# EAGLE design Baos_Board (EAGLE 9.3.0)

## Sheet 1 of 3
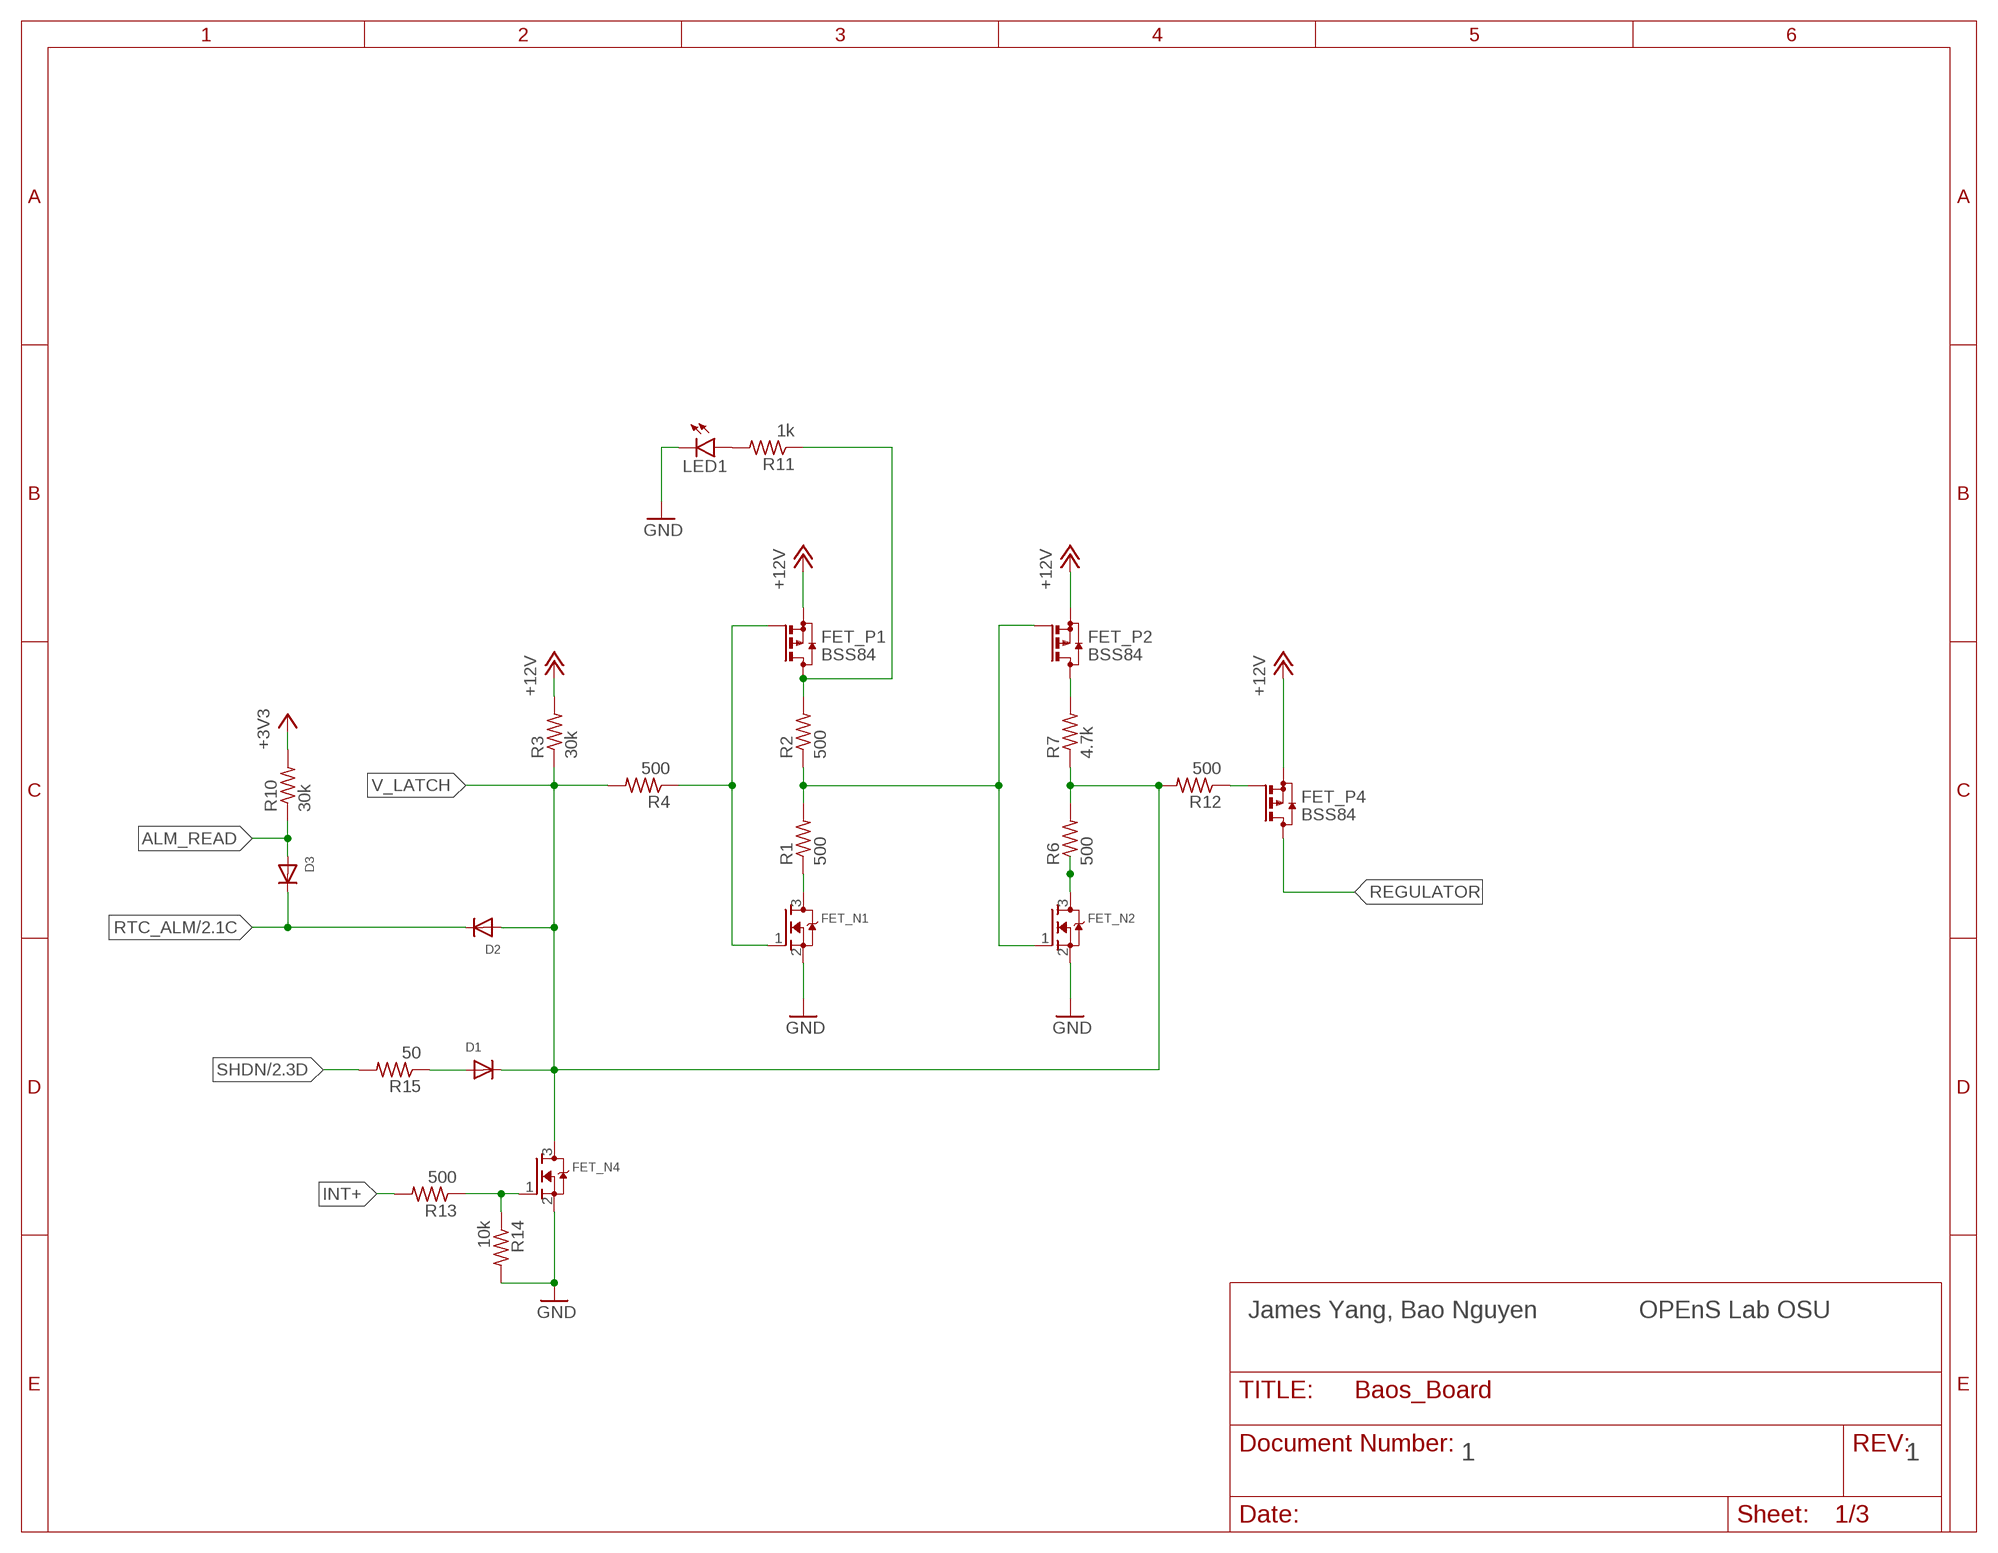
[diagram p0: schematic, sheet 1]

### Parts
D1  DIODESOD-123  [SOD-123]
D2  DIODESOD-123  [SOD-123]
D3  DIODESOD-123  [SOD-123]
FET_N1  MOSFET-NREFLOW  [SOT23]
FET_N2  MOSFET-NREFLOW  [SOT23]
FET_N4  MOSFET-NREFLOW  [SOT23]
FET_P1  BSS84  [SOT23]
FET_P2  BSS84  [SOT23]
FET_P4  BSS84  [SOT23]
LED1  LEDSMT1206  [1206]
R1  500  R-US_R0805  [R0805]
R2  500  R-US_R0805  [R0805]
R3  30k  R-US_R0805  [R0805]
R4  500  R-US_R0805  [R0805]
R6  500  R-US_R0805  [R0805]
R7  4.7k  R-US_R0805  [R0805]
R10  30k  R-US_R0805  [R0805]
R11  1k  R-US_R0805  [R0805]
R12  500  R-US_R0805  [R0805]
R13  500  R-US_R0805  [R0805]
R14  10k  R-US_R0805  [R0805]
R15  50  R-US_R0805  [R0805]

### Nets
+3V3: R10.2 ; also sheet 2
+12V: FET_P1.2(S) FET_P2.2(S) FET_P4.2(S) R3.2 ; also sheet 2
ALM_READ: D3.A R10.1 ; also sheet 2
GND: FET_N1.2(S) FET_N2.2(S) FET_N4.2(S) LED1.C R14.2 ; also sheet 2
INT+: R13.2
N$1: FET_P1.3(D) R2.2 R11.1
N$2: FET_N1.3(D) R1.1
N$3: FET_N1.1(G) FET_P1.1(G) R4.1
N$4: FET_N2.1(G) FET_P2.1(G) R1.2 R2.1
N$6: FET_P2.3(D) R7.2
N$7: FET_N2.3(D) R6.1
N$9: LED1.A R11.2
N$10: FET_P4.1(G) R12.1
N$11: D1.A R15.1
N$12: FET_N4.1(G) R13.1 R14.1
REGULATOR: FET_P4.3(D) ; also sheet 2
RTC_ALM: D2.C D3.C ; also sheet 2
SHDN: R15.2 ; also sheet 2
V_LATCH: D1.C D2.A FET_N4.3(D) R3.1 R4.2 R6.2 R7.1 R12.2 ; also sheet 2

### Notes on the sheet
- James Yang, Bao Nguyen | OPEnS Lab OSU
- 1 | 1

## Sheet 2 of 3
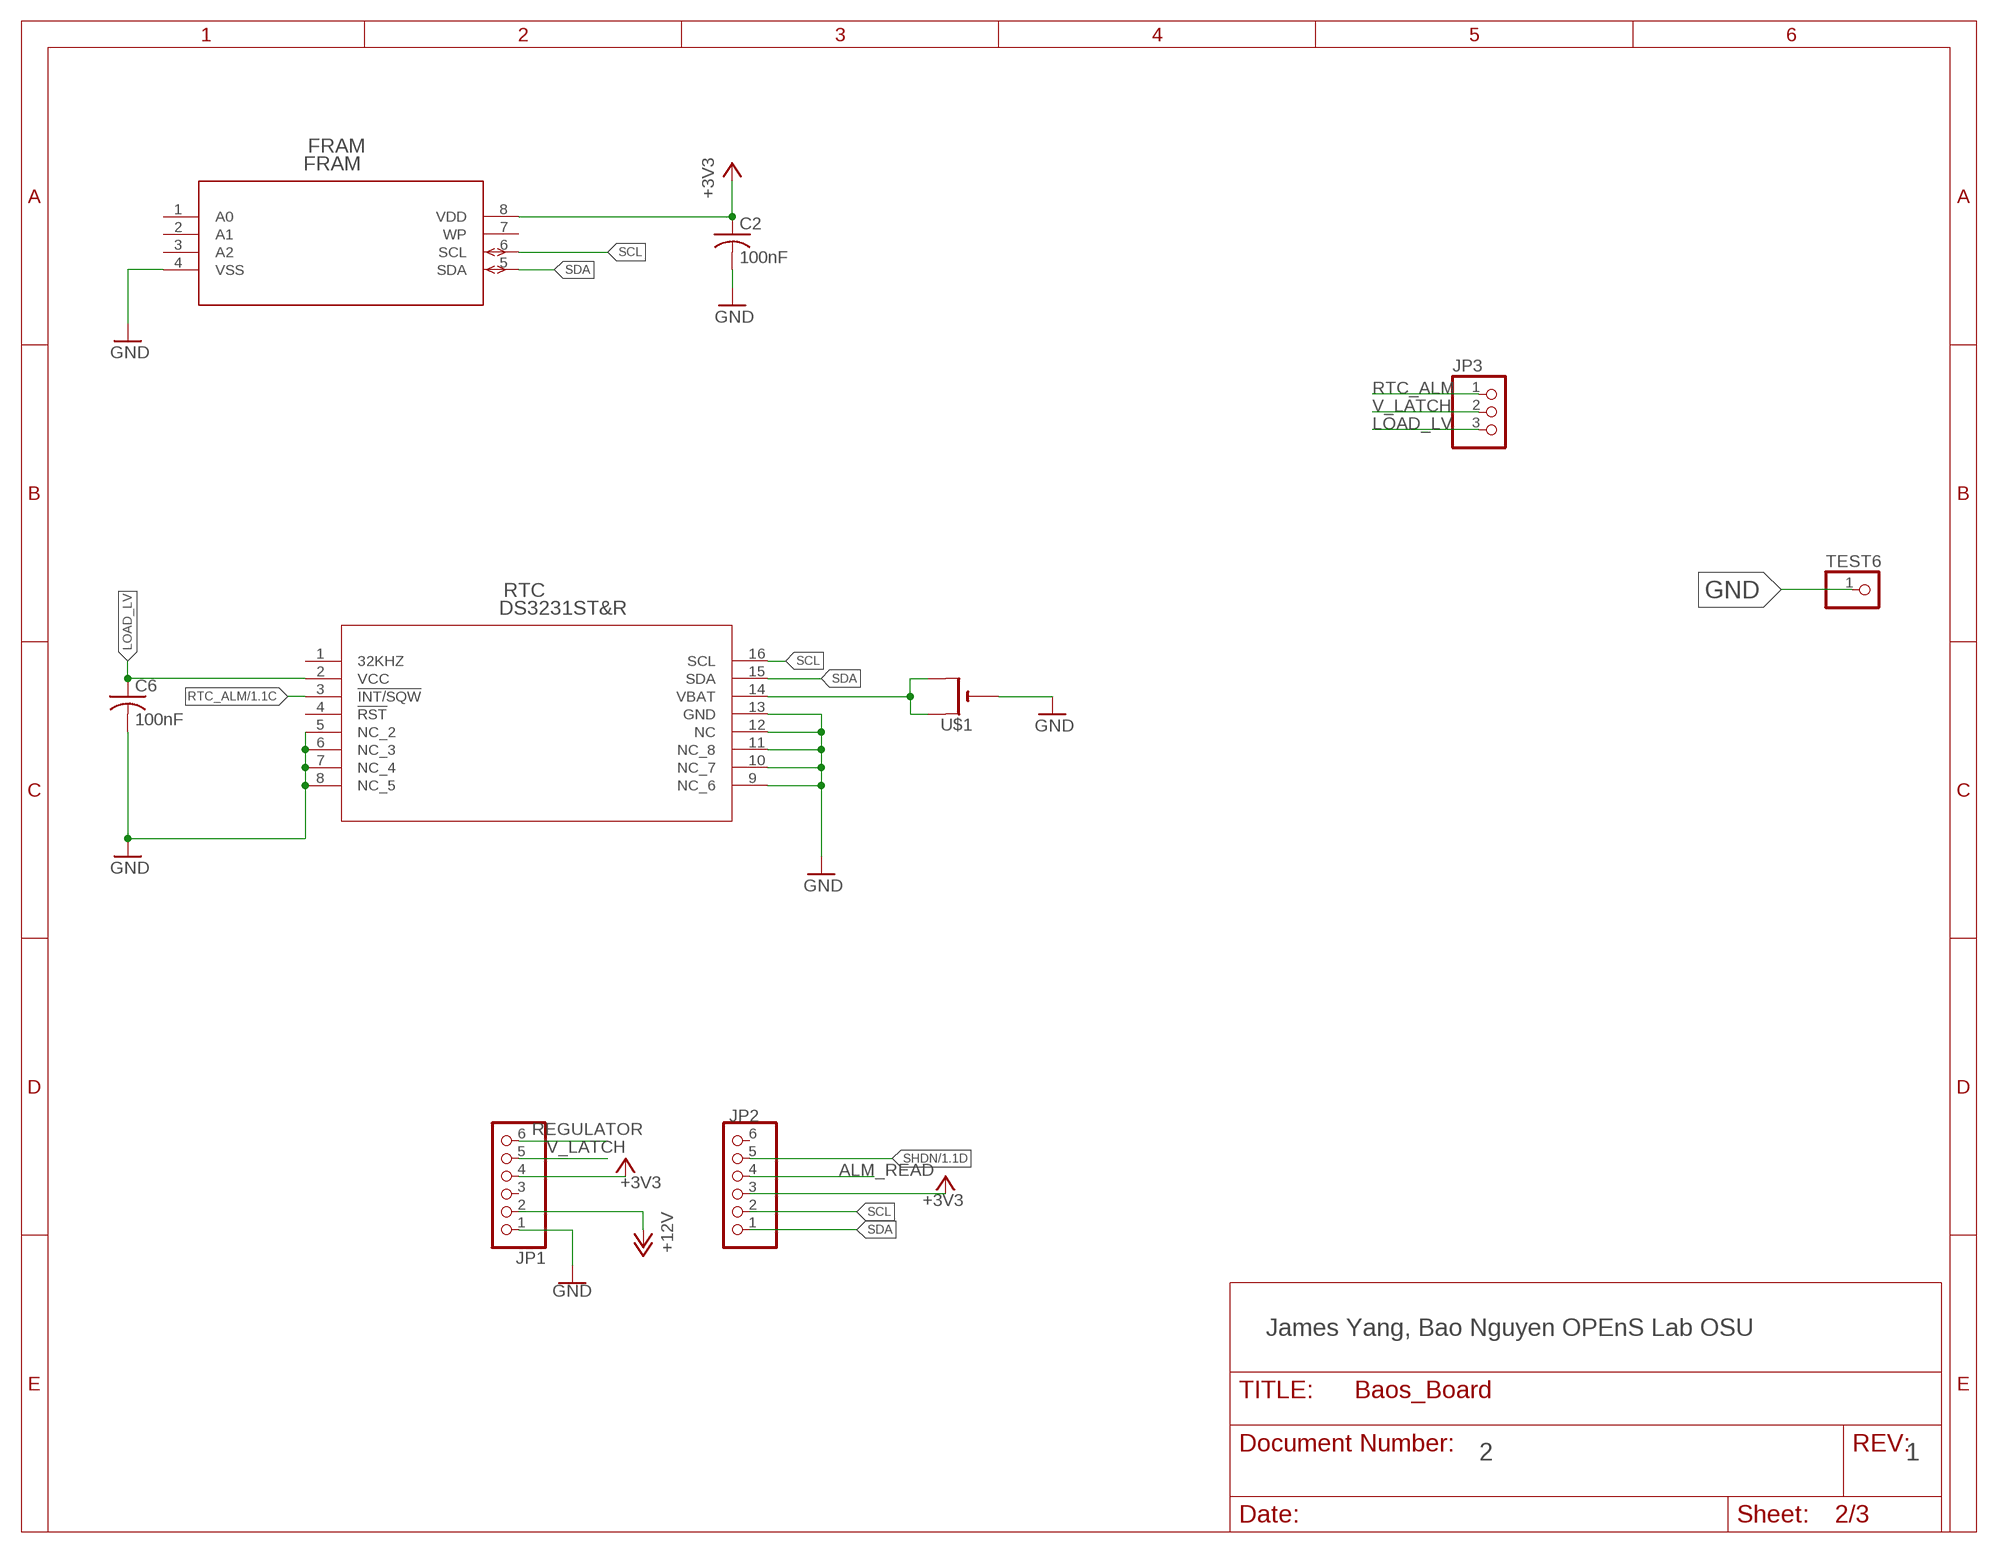
[diagram p1: schematic, sheet 2]

### Parts
C2  100nF  C-USC0805  [C0805]
C6  100nF  C-USC0805  [C0805]
FRAM  FRAM  [FPT-8P-M02]
JP1  PINHD-1X6  [1X06]
JP2  PINHD-1X6  [1X06]
JP3  PINHD-1X3  [1X03]
RTC  DS3231ST&R  [21-0042B_16]
TEST6  PINHD-1X1  [1X01]
U$1  CR1220SMT  [CR1220-SMD]

### Nets
+3V3: C2.1 FRAM.8(VDD) JP1.4 JP2.3 ; also sheet 1
+12V: JP1.2 ; also sheet 1
ALM_READ: JP2.4 ; also sheet 1
GND: C2.2 C6.2 FRAM.4(VSS) JP1.1 RTC.5(NC_2) RTC.6(NC_3) RTC.7(NC_4) RTC.8(NC_5) RTC.9(NC_6) RTC.10(NC_7) RTC.11(NC_8) RTC.12(NC) RTC.13(GND) TEST6.1 U$1.- ; also sheet 1
LOAD_LV: C6.1 JP3.3 RTC.2(VCC)
N$5: RTC.14(VBAT) U$1.+$1(+) U$1.+$2(+1)
REGULATOR: JP1.6 ; also sheet 1
RTC_ALM: JP3.1 RTC.3(!INT/SQW) ; also sheet 1
SCL: FRAM.6(SCL) JP2.2 RTC.16(SCL)
SDA: FRAM.5(SDA) JP2.1 RTC.15(SDA)
SHDN: JP2.5 ; also sheet 1
V_LATCH: JP1.5 JP3.2 ; also sheet 1
Unconnected: FRAM.1(A0) FRAM.2(A1) FRAM.3(A2) FRAM.7(WP) JP1.3 JP2.6 RTC.1(32KHZ) RTC.4(!RST)

### Notes on the sheet
- James Yang, Bao Nguyen OPEnS Lab OSU
- 2 | 1

## Sheet 3 of 3

## Library data of the parts
C2 C6 = adafruit:C-US: CAPACITOR, American symbol
D1-D3 = adafruit:DIODE: Diode SMADIODE - SMA Surface Mount Package 20V 1A Schottky Diode Digikey: 641-1014-6-ND DO-1N4148 - Through Hole Small Current Diode SOD-123 20V 1 A (.5mV Vf) Schottky Diode - Digikey: MBRX120TPMSCT-ND SOD-323 10V 570mA (.38mV Vf, 3ns) Schottky Diode - Digikey: ZLLS410CT-ND SOD-523 30V 30mA Schottky Diode (RB751S-40TE61) - Digikey: RB751S-40TE61CT-ND SOT23-R/W - SOT23 Package (R = Solder Paste/Reflow Ovens, W = Hand-Soldering) BAT54Film 40V 300mA - Digikey: 497-7162-1-ND
FET_N1 FET_N2 FET_N4 = adafruit:MOSFET-N: N-Channel Mosfet 2N7002E - 60V 260mA SOT23 [Digikey: 2N7002ET1GOSTR-ND] - REEL BSH103 - 30V 850mA SOT23 [Digikey: 568-5013-1-ND]
FET_P1 FET_P2 FET_P4 = transistor-small-signal:BSS84: P-CHANNEL MOS FET
FRAM = power8:FRAM: MB85RC128APNF-G-JNE1, FRAM 128k, 128kb, I2C; MANUFACTURER_PART_NUMBER: Inc.; VENDOR: Fujitsu Semiconductor
JP1 JP2 = adafruit:PINHD-1X6: PIN HEADER
JP3 = adafruit:PINHD-1X3: PIN HEADER
LED1 = led:LED: LED OSRAM: - CHIPLED LG R971, LG N971, LY N971, LG Q971, LY Q971, LO R971, LY R971 LH N974, LH R974 LS Q976, LO Q976, LY Q976 LO Q996 - Hyper CHIPLED LW Q18S LB Q993, LB Q99A, LB R99A - SideLED LS A670, LO A670, LY A670, LG A670, LP A670 LB A673, LV A673, LT A673, LW A673 LH A674 LY A675 LS A676, LA A676, LO A676, LY A676, LW A676 LS A679, LY A679, LG A679 - Hyper Micro SIDELED® LS Y876, LA Y876, LO Y876, LY Y876 LT Y87S - SmartLED LW L88C, LW L88S LB L89C, LB L89S, LG L890 LS L89K, LO L89K, LY L89K LS L896, LA L896, LO L896, LY L896 - TOPLED LS T670, LO T670, LY T670, LG T670, LP T670 LSG T670, LSP T670, LSY T670, LOP T670, LYG T670 LG T671, LOG T671, LSG T671 LB T673, LV T673, LT T673, LW T673 LH T674 LS T676, LA T676, LO T676, LY T676, LB T676, LH T676, LSB T676, LW T676 LB T67C, LV T67C, LT T67C, LS T67K, LO T67K, LY T67K, LW E67C LS E67B, LA E67B, LO E67B, LY E67B, LB E67C, LV E67C, LT E67C LW T67C LS T679, LY T679, LG T679 LS T770, LO T770, LY T770, LG T770, LP T770 LB T773, LV T773, LT T773, LW T773 LH T774 LS E675, LA E675, LY E675, LS T675 LS T776, LA T776, LO T776, LY T776, LB T776 LHGB T686 LT T68C, LB T68C - Hyper Mini TOPLED® LB M676 - Mini TOPLED Santana® LG M470 LS M47K, LO M47K, LY M47K Source: http://www.osram.convergy.de LUXEON: - LUMILED® LXK2-PW12-R00, LXK2-PW12-S00, LXK2-PW14-U00, LXK2-PW14-V00 LXK2-PM12-R00, LXK2-PM12-S00, LXK2-PM14-U00 LXK2-PE12-Q00, LXK2-PE12-R00, LXK2-PE12-S00, LXK2-PE14-T00, LXK2-PE14-U00 LXK2-PB12-K00, LXK2-PB12-L00, LXK2-PB12-M00, LXK2-PB14-N00, LXK2-PB14-P00, LXK2-PB14-Q00 LXK2-PR12-L00, LXK2-PR12-M00, LXK2-PR14-Q00, LXK2-PR14-R00 LXK2-PD12-Q00, LXK2-PD12-R00, LXK2-PD12-S00 LXK2-PH12-R00, LXK2-PH12-S00 LXK2-PL12-P00, LXK2-PL12-Q00, LXK2-PL12-R00 Source: www.luxeon.com KINGBRIGHT: KA-3528ASYC Source: www.kingbright.com
R1-R4 R6 R7 R10-R15 = rcl:R-US_: RESISTOR, American symbol; SPICEPREFIX: R
RTC = power8:DS3231ST&R: DS3231 RTC IC only; MANUFACTURER_PART_NUMBER: DS3231S#T&R; VENDOR: Maxim Integrated Products
TEST6 = pinhead:PINHD-1X1: PIN HEADER
U$1 = adafruit:CR1220: CR1216/CR1220/CR1225 12mm 3V lithium coin cell Great for battery packup. Both SMT and THM holders. Note the THM package has the ground pads on both sides of the PCB so that the masks are the same - this reduces the cost

## Board
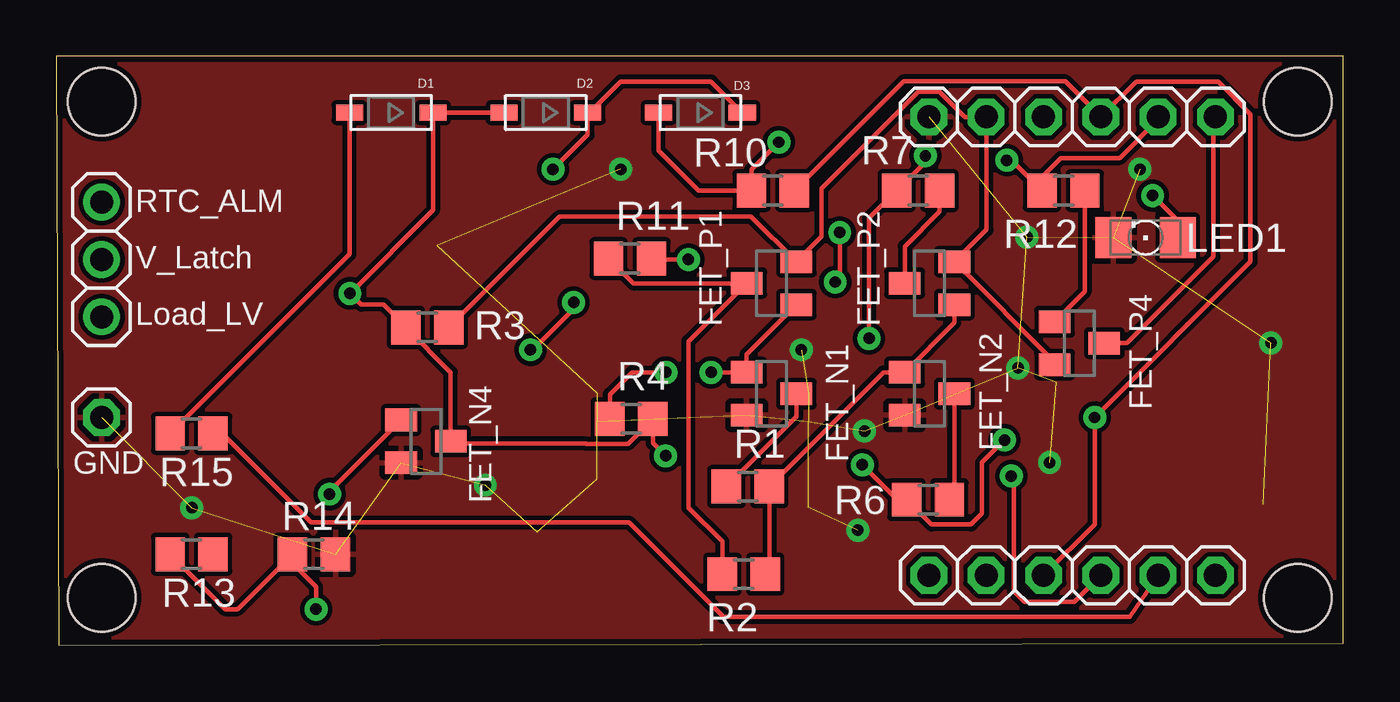
[diagram p2: board, top side]
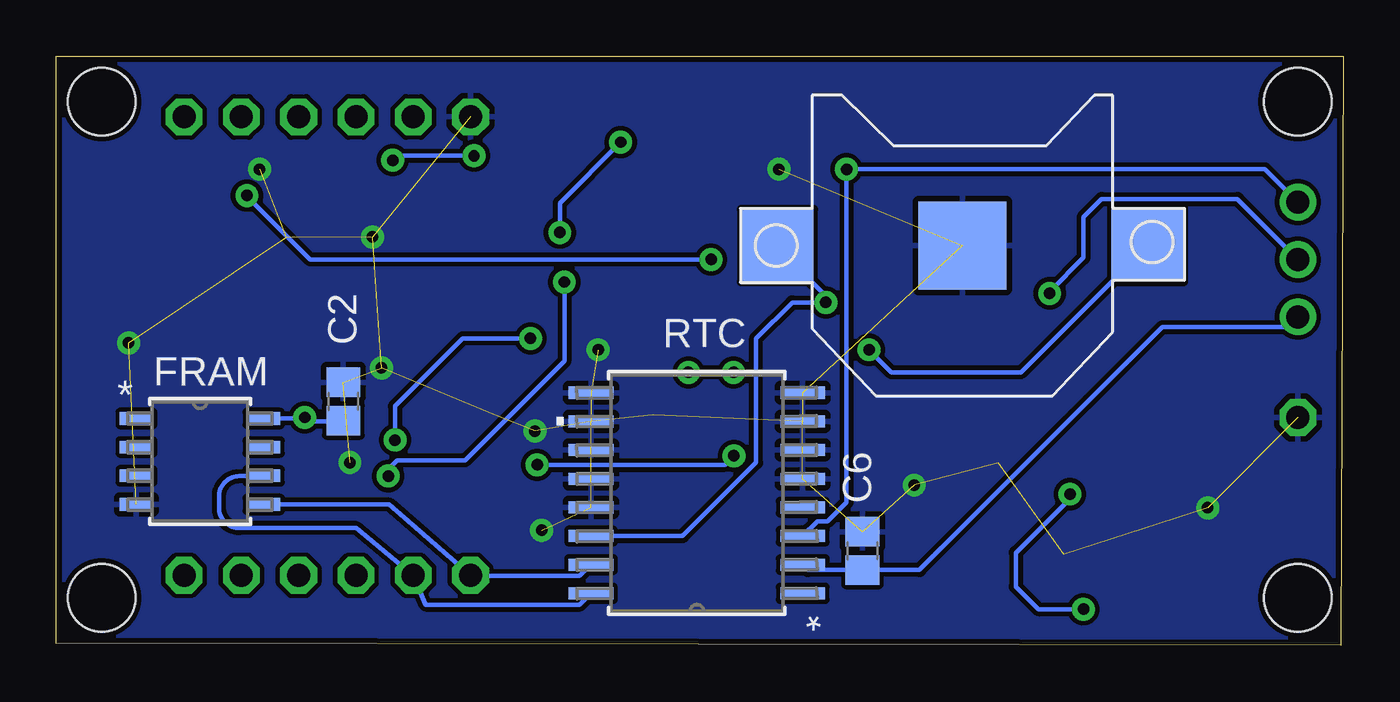
[diagram p3: board, bottom side, seen from below]

Size 57 x 26.1 mm. Coordinates in mm from the lower left corner, seen from the top.
Outline: 0.1,0 57,0.1 57,26.1 0,26.1 0.1,0
Copper layers (1*16): Top 0.035mm / dielectric 1.5mm / Bottom 0.035mm
Design rules "SparkFun": minimum track width 8mil, minimum drill 20mil, track to track 8mil, track to pad 8mil, pad to pad 8mil, via to via 8mil, smd to smd 8mil, copper to edge 10mil, drill to drill 8mil, minimum pad ring 12mil, minimum via ring 10mil, stop-mask expansion 4mil, vias tented up to drill 25mil, thermal gap 10mil
Holes 3 mm at 55,24.1 55,2.1 2,24.1 2,2.1

### Footprints (pad centres in the part's own frame; a part is rotated, then mirrored left to right if it is on the bottom)
C0805 = smd 1.3 x 1.5: 1 -0.85,0; 2 0.85,0
SOD-123 = smd 1.2 x 0.7: A 1.85,0; C -1.85,0
SOT23 = smd 1 x 1.4: 1 -0.95,-1.1; 2 0.95,-1.1; 3 0,1.1
FPT-8P-M02 = smd 1.473 x 0.559: 1 -2.819,1.905; 2 -2.819,0.635; 3 -2.819,-0.635; 4 -2.819,-1.905; 5 2.819,-1.905; 6 2.819,-0.635; 7 2.819,0.635; 8 2.819,1.905
1X06 = drill 1.016 octagon: 1 -6.35,0; 2 -3.81,0; 3 -1.27,0; 4 1.27,0; 5 3.81,0; 6 6.35,0
1X03 = drill 1.016: 1 -2.54,0; 2 0,0; 3 2.54,0
1206 = smd 1.6 x 1.803: A -1.422,0; C 1.422,0
R0805 = smd 1.3 x 1.5: 1 -0.95,0; 2 0.95,0
21-0042B_16 = smd 1.981 x 0.533: 1 -4.686,4.445; 2 -4.686,3.175; 3 -4.686,1.905; 4 -4.686,0.635; 5 -4.686,-0.635; 6 -4.686,-1.905; 7 -4.686,-3.175; 8 -4.686,-4.445; 9 4.686,-4.445; 10 4.686,-3.175; 11 4.686,-1.905; 12 4.686,-0.635; 13 4.686,0.635; 14 4.686,1.905; 15 4.686,3.175; 16 4.686,4.445
1X01 = drill 1.016 octagon: 1 0,0
CR1220-SMD = smd 3.2 x 3.2: +$1 -8.2,0; +$2 8.2,0 | smd 3.9 x 3.9: - 0,0

### Placement (x,y rotation side)
C2  44.29,10.81 90 bottom
C6  21.29,4.19 90 bottom
D1  14.83,23.61 180 top
D2  21.68,23.61 180 top
D3  28.53,23.61 180 top
FET_N1  31.68,11.15 270 top
FET_N2  38.68,11.15 270 top
FET_N4  16.37,9.04 270 top
FET_P1  31.68,16.05 90 top
FET_P2  38.68,16.05 90 top
FET_P4  45.32,13.39 270 top
FRAM  50.64,8.15 0 bottom
JP1  45,23.42 0 top
JP2  45,3.1 0 top
JP3  2,17.1 270 top
LED1  48.25,18.07 180 top
R1  30.63,7.04 0 top
R2  30.45,3.16 180 top
R3  16.43,14.09 0 top
R4  25.47,10.04 0 top
R6  38.61,6.46 180 top
R7  38.17,20.15 0 top
R10  31.74,20.15 0 top
R11  25.41,17.14 0 top
R12  44.61,20.15 180 top
R13  5.99,4.04 0 top
R14  11.41,4.04 0 top
R15  5.99,9.39 0 top
RTC  28.63,6.75 180 bottom
TEST6  2,10.1 0 top
U$1  16.86,17.72 0 bottom

### Tracks (layer width: path | path; a pad name or v marks a point on that pad's centre or on a via)
+3V3  (via drill 0.51)
  Top 0.203: JP2.3 46,5.37 v46,10.1 52.9,17 52.9,23.55 51.46,24.98 47.83,24.98 JP1.4 44.69,25 37.54,25 R10.2
  Bottom 0.203: C2.1 44.33,9.92 45.83,9.92 v46,10.1 46.05,10.05 FRAM.8
+12V
  Top 0.203: FET_P4.2 44.22,12.56 FET_P2.2 41.2,18.42 JP1.2 | R3.2 22.29,19 30.78,19 FET_P1.2 33.89,18.11 33.89,20.24 38.19,24.54 39.11,24.54 40.24,23.41 JP1.2 | JP1.2
ALM_READ  (via drill 0.51)
  Top 0.203: D3.A 26.68,21.92 28.45,20.15 R10.1 30.79,21.09 v32,22.3 | v34.7,18.3 34.7,16.3 v34.5,16.1 | v42.3,7.5 42.42,7.38 42.42,2.39 42.88,1.93 45.1,1.93 JP2.4
  Bottom 0.203: v34.5,16.1 34.5,12.6 38.9,8.2 41.9,8.2 42.3,7.8 v42.3,7.5 | v34.7,18.3 34.7,19.6 v32,22.3
GND  (via drill 0.51)  (30 unrouted)
  other vias: 35.8,9.5 53.8,13.4 25,21.1 6,6.1 43,18.1 48,21.1 35.5,5.1 44,8.1 42.6,12.3 19,7.1 33,13.1
  pour Bottom: 0.2,26 0.2,0.1 56.7,0.1 56.7,26
  pour Top: 0.2,26 0.2,0.1 56.6,0.1 56.6,26
LOAD_LV
  Bottom 0.203: RTC.2 23.71,3.34 C6.1 18.76,3.34 8,14.1 2.46,14.1 JP3.3
N$1
  Top 0.203: R2.2 29.5,4.6 28,6.1 28,13.47 30.57,16.04 | 30.57,16.04 FET_P1.3 | R11.1 25.57,16.04 30.57,16.04
N$2
  Top 0.203: R1.1 32.78,10.14 FET_N1.3
N$3  (via drill 0.51)
  Top 0.203: R4.1 24.52,11.12 25.5,12.1 v27,12.1 | v29,12.1 FET_N1.1 30.58,12.9 FET_P1.1
  Bottom 0.203: v27,12.1 v29,12.1
N$4
  Top 0.203: R2.1 31.58,3.34 R1.2 36.64,12.1 FET_N2.1 39.78,14.3 FET_P2.1
N$5  (via drill 0.51)
  Top 0.203: v21,13.1 21.1,13.1 22.91,14.91 v22.91,15.2
  Bottom 0.203: U$1.+$2 14.28,12.1 20,12.1 v21,13.1 | U$1.+$1 25.06,17.62 22.91,15.47 v22.91,15.2 24.4,15.2 26,13.6 26,8.1 29.25,4.84 RTC.14
N$6
  Top 0.203: R7.2 39.12,19.23 37.58,17.68 FET_P2.3
N$7
  Top 0.203: R6.1 39.78,6.68 FET_N2.3
N$9  (via drill 0.51)
  Top 0.203: v28,17.1 26.4,17.1 R11.2 | v48.56,19.94 49.67,18.83 LED1.A
  Bottom 0.203: v28,17.1 45.76,17.1 48.56,19.9 v48.56,19.94
N$10
  Top 0.203: R12.1 45.56,15.68 FET_P4.1
N$11
  Top 0.203: R15.1 12.98,17.33 D1.A
N$12  (via drill 0.51)
  Top 0.203: R13.1 7.48,1.6 8.02,1.6 10.26,3.84 | 10.26,3.84 R14.1 | FET_N4.1 12.1,6.82 v12.1,6.7 | v11.5,1.6 11.5,2.6 10.26,3.84
  Bottom 0.203: v12.1,6.7 12.1,6.5 14.5,4.1 14.5,2.6 13.5,1.6 v11.5,1.6
REGULATOR
  Top 0.203: FET_P4.3 47.42,13.39 51.25,17.22 51.25,23.32 JP1.6
RTC_ALM  (via drill 0.51)
  Top 0.203: v22,21.1 23.53,22.63 D2.C | D2.C | D3.C 29.01,24.98 25,24.98 23.62,23.6 D2.C
  Bottom 0.203: RTC.3 23.29,5.49 22.85,5.49 22,6.34 v22,21.1 3.46,21.1 JP3.1
SCL
  Bottom 0.203: FRAM.6 arc90 47.84,7.5 48.9,7.5 arc-90 49.8,6.6 49.8,6.1 arc-90 48.9,5.2 43.73,5.2 JP2.2 40.64,1.81 33.82,1.81 RTC.16
SDA
  Bottom 0.203: FRAM.5 42.26,6.24 JP2.1 38.62,3.08 33.82,3.08 RTC.15
SHDN
  Top 0.203: R15.2 7.34,9.39 11.29,5.44 25.36,5.44 29.55,1.26 47.55,1.26 JP2.5
V_LATCH  (via drill 0.51)
  Top 0.203: D2.A D1.C 16.68,19.28 v13,15.6 13.5,15.1 14.5,15.1 15.49,14.11 R3.1 17.47,12.1 FET_N4.3 17.57,8.94 23.46,8.94 25.32,8.94 R4.2 26.42,8.97 v26.99,8.4 | v35.7,8 37.24,6.46 R6.2 38.76,5.36 40.52,5.36 41,5.84 41,8.1 v42,9.1 | v36,13.6 36,18.93 R7.1 38.5,21.42 v38.5,21.7 | v42.1,21.5 42.31,21.5 R12.2 43.66,20.76 44.5,21.6 47.1,21.6 48.81,23.31 JP1.5
  Bottom 0.203: v35.7,8 27.39,8 v26.99,8.4 | v36,13.6 39,13.6 42,10.6 v42,9.1 | v42.1,21.5 41.9,21.7 v38.5,21.7 | v13,15.6 13,15.68 11.5,17.18 11.5,18.98 10.7,19.78 4.68,19.78 JP3.2

### Text on the board
tPlace: RTC_ALM | V_Latch | Load_LV | GND